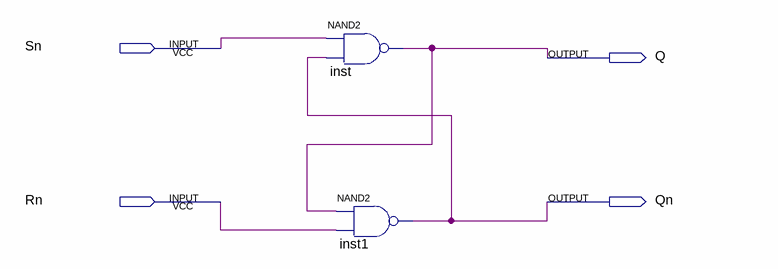
[diagram p0: schematic sheet]
// Quartus schematic LATCH_TIPO_NAND.bdf as structural Verilog: 2 symbols, 4 pins
module LATCH_TIPO_NAND (
  input  Sn,
  input  Rn,
  output Q,
  output Qn
);

  nand inst (Q, Sn, Qn);
  nand inst1 (Qn, Q, Rn);
endmodule
